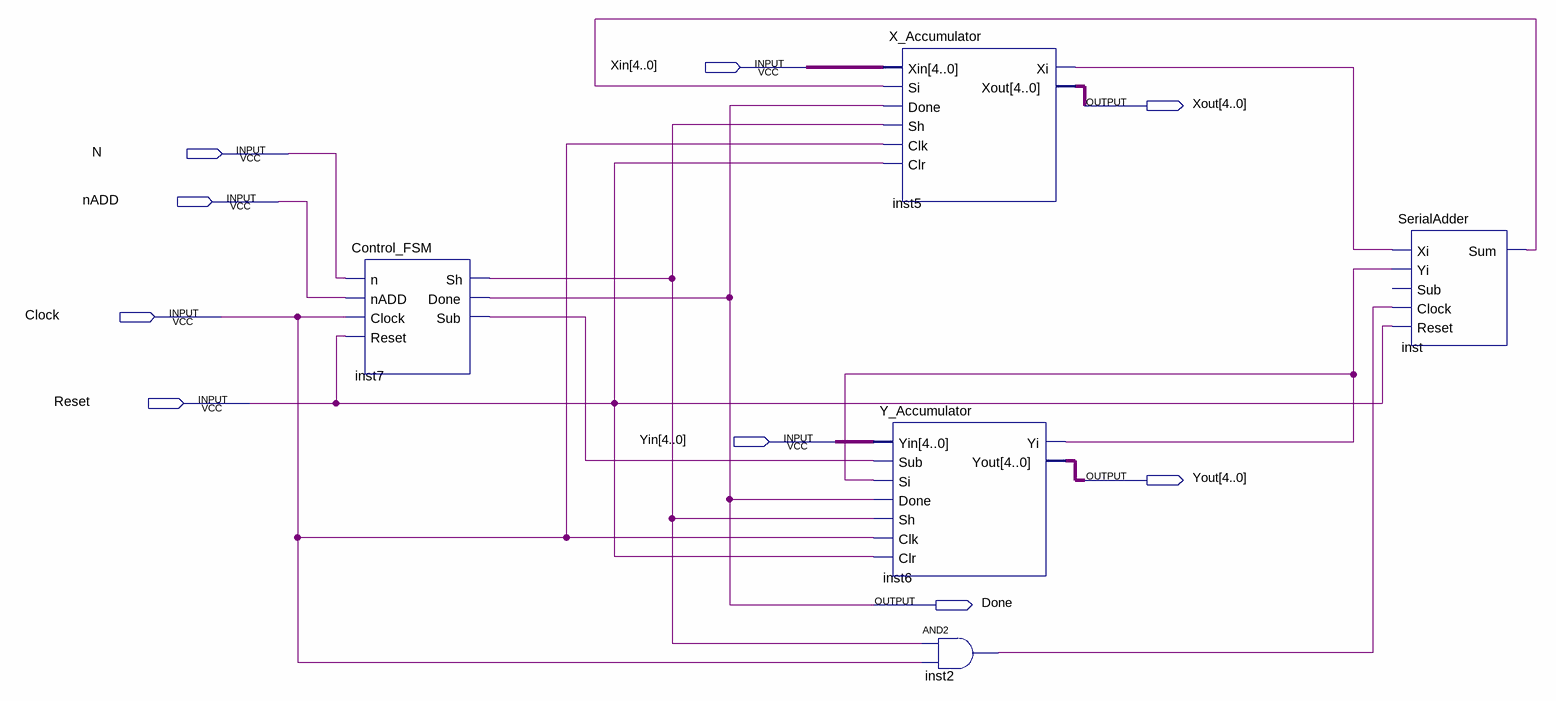
[diagram p0: schematic sheet]
// Quartus schematic BitSerialAdder.bdf as structural Verilog: 5 symbols, 9 pins
module BitSerialAdder (
  input  [4:0] Xin,
  input  N,
  input  nADD,
  input  Clock,
  input  Reset,
  input  [4:0] Yin,
  output [4:0] Xout,
  output [4:0] Yout,
  output Done
);

  wire inst2_out, inst5_xi, inst6_yi, inst7_sh, inst7_sub, inst_sum;

  Control_FSM inst7 (.n(N), .nADD(nADD), .Clock(Clock), .Reset(Reset), .Sh(inst7_sh), .Done(Done), .Sub(inst7_sub));
  X_Accumulator inst5 (
    .Xin(Xin), .Si(inst_sum), .Done(Done), .Sh(inst7_sh), .Clk(Clock), .Clr(Reset), .Xi(inst5_xi), .Xout(Xout));
  Y_Accumulator inst6 (
    .Yin(Yin), .Sub(inst7_sub), .Si(inst6_yi), .Done(Done), .Sh(inst7_sh), .Clk(Clock), .Clr(Reset),
    .Yi(inst6_yi), .Yout(Yout));
  and inst2 (inst2_out, inst7_sh, Clock);
  SerialAdder inst (.Xi(inst5_xi), .Yi(inst6_yi), .Clock(inst2_out), .Reset(Reset), .Sum(inst_sum));  // open: Sub
endmodule
